# EAGLE design drum_circuits (EAGLE 7.6.0)
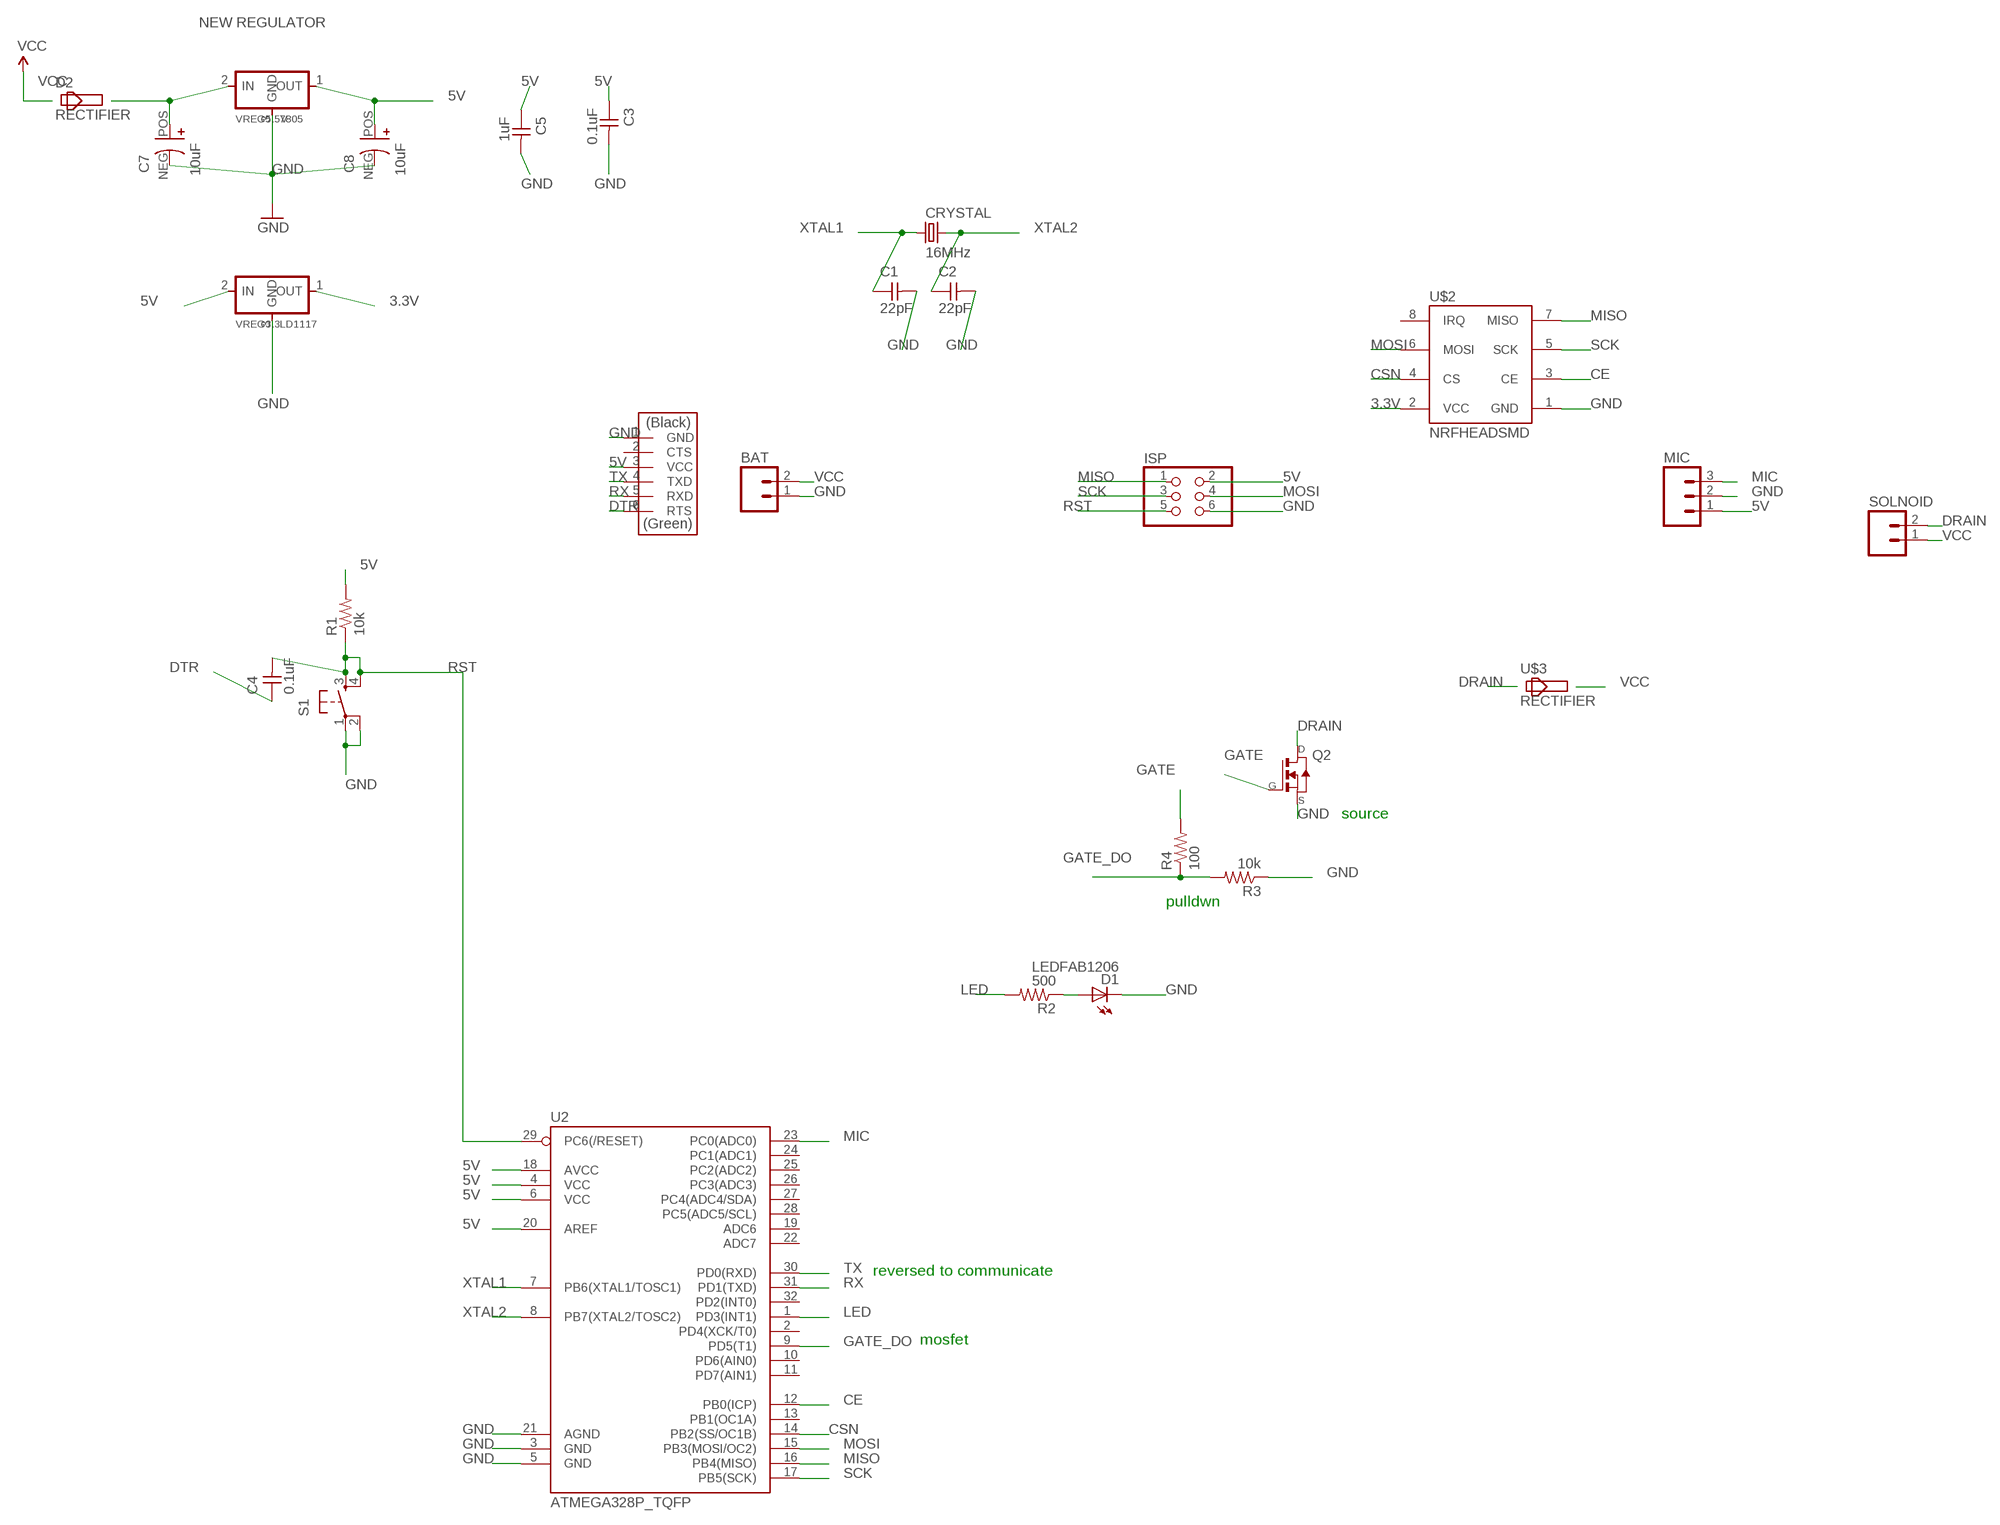
[diagram p0: schematic, sheet 1]

## Parts
BAT  M02PTH  [1X02]
C1  22pF  CAP-UNPOLARIZEDFAB  [C1206FAB]
C2  22pF  CAP-UNPOLARIZEDFAB  [C1206FAB]
C3  0.1uF  CAP-UNPOLARIZEDFAB  [C1206FAB]
C4  0.1uF  CAP-UNPOLARIZEDFAB  [C1206FAB]
C5  1uF  CAP-UNPOLARIZEDFAB  [C1206FAB]
C7  10uF  POLCAP-PANASONIC-SMD-B01  [PANASONIC-CAP-SMD-B]
C8  10uF  POLCAP-PANASONIC-SMD-B01  [PANASONIC-CAP-SMD-B]
CRYSTAL  16MHz  CRYSTAL  [2-SMD-5X3MM]
D1  LEDFAB1206  [LED1206FAB]
D2  RECTIFIER  [RECTIFIER]
ISP  PINHD-2X3-SMD  [2X03SMD]
MIC  M03PTH  [1X03]
Q2  NMOSFETSOT23  [SOT-23]
R1  10k  RES-US1206FAB  [R1206FAB]
R2  500  RES-US1206FAB  [R1206FAB]
R3  10k  RES-US1206FAB  [R1206FAB]
R4  100  RES-US1206FAB  [R1206FAB]
S1  6MM_SWITCH6MM_SWITCH  [6MM_SWITCH]
SOLNOID  M02PTH  [1X02]
U2  ATMEGA328P_TQFP  [TQFP32-08]
U$1  FTDI-SMD-HEADER  [1X06SMD]
U$2  NRFHEADSMD  [2.54MM]
U$3  RECTIFIER  [RECTIFIER]
VREG3.3  LD1117  REGULATORSOT23  [SOT23]
VREG5.5V  7805  REGULATORSOT23  [SOT23]

## Nets
3.3V: U$2.2(VCC) VREG3.3.1(OUT)
5V: C3.1 C5.1 C8.POS(+) ISP.2 MIC.1 R1.2 U2.4(VCC) U2.6(VCC) U2.18(AVCC) U2.20(AREF) U$1.3(VCC) VREG3.3.2(IN) VREG5.5V.1(OUT)
CE: U2.12(PB0(ICP)) U$2.3(CE)
CSN: U2.14(PB2(SS/OC1B)) U$2.4(CS)
DRAIN: Q2.1(D) SOLNOID.2 U$3.1
DTR: C4.1 U$1.6(RTS)
GATE: Q2.3(G) R4.2
GATE_DO: R3.2 R4.1 U2.9(PD5(T1))
GND: BAT.1 C1.2 C2.2 C3.2 C5.2 C7.NEG(-) C8.NEG(-) D1.2(C) ISP.6 MIC.2 Q2.2(S) R3.1 S1.1(P) S1.2(P1) U2.3(GND) U2.5(GND) U2.21(AGND) U$1.1(GND) U$2.1(GND) VREG3.3.3(GND) VREG5.5V.3(GND)
LED: R2.2 U2.1(PD3(INT1))
MIC: MIC.3 U2.23(PC0(ADC0))
MISO: ISP.1 U2.16(PB4(MISO)) U$2.7(MISO)
MOSI: ISP.4 U2.15(PB3(MOSI/OC2)) U$2.6(MOSI)
N$1: D1.1(A) R2.1
N$4: C7.POS(+) D2.2 VREG5.5V.2(IN)
RST: C4.2 ISP.5 R1.1 S1.3(S) S1.4(S1) U2.29(PC6(/RESET))
RX: U2.31(PD1(TXD)) U$1.5(RXD)
SCK: ISP.3 U2.17(PB5(SCK)) U$2.5(SCK)
TX: U2.30(PD0(RXD)) U$1.4(TXD)
VCC: BAT.2 D2.1 SOLNOID.1 U$3.2
XTAL1: C1.1 CRYSTAL.P$1 U2.7(PB6(XTAL1/TOSC1))
XTAL2: C2.1 CRYSTAL.P$2 U2.8(PB7(XTAL2/TOSC2))
Unconnected: U2.2(PD4(XCK/T0)) U2.10(PD6(AIN0)) U2.11(PD7(AIN1)) U2.13(PB1(OC1A)) U2.19(ADC6) U2.22(ADC7) U2.24(PC1(ADC1)) U2.25(PC2(ADC2)) U2.26(PC3(ADC3)) U2.27(PC4(ADC4/SDA)) U2.28(PC5(ADC5/SCL)) U2.32(PD2(INT0)) U$1.2(CTS) U$2.8(IRQ)

## Notes on the sheet
- NEW REGULATOR
- source
- pulldwn
- reversed to communicate
- mosfet

## Library data of the parts
BAT SOLNOID = SparkFun-Connectors:M02: Standard 2-pin 0.1" header. Use with - straight break away headers ( PRT-00116) - right angle break away headers (PRT-00553) - swiss pins (PRT-00743) - machine pins (PRT-00117) - female headers (PRT-00115) Molex polarized connector foot print use with: PRT-08233 with associated crimp pins and housings. 2.54_SCREWTERM for use with PRT-10571. 3.5mm Screw Terminal footprints for PRT-08084 5mm Screw Terminal footprints for use with PRT-08432
C1-C5 = fab:CAP-UNPOLARIZED
C7 C8 = talkingdrums:POLCAP-PANASONIC-SMD-B
CRYSTAL = fab:CRYSTAL
D1 = fab:LED: LED
D2 U$3 = talkingdrums:RECTIFIER
ISP = fab:PINHD-2X3-SMD: PIN HEADER
MIC = SparkFun-Connectors:M03: Header 3 Standard 3-pin 0.1" header. Use with straight break away headers (SKU : PRT-00116), right angle break away headers (PRT-00553), swiss pins (PRT-00743), machine pins (PRT-00117), and female headers (PRT-00115). Molex polarized connector foot print use with SKU : PRT-08232 with associated crimp pins and housings.
Q2 = fab:NMOSFET: MOS FET
R1-R4 = fab:RES-US: Resistor (US Symbol) Variants with postfix FAB are widened to allow the routing of internal traces
S1 = fab:6MM_SWITCH: OMRON SWITCH
U2 = SparkFun-DigitalIC:ATMEGA328P_TQFP; PROD_ID: IC-09069
U$1 = fab:FTDI-SMD-HEADER
U$2 = nrf:NRFHEAD
VREG3.3 VREG5.5V = fab:REGULATOR

## Board
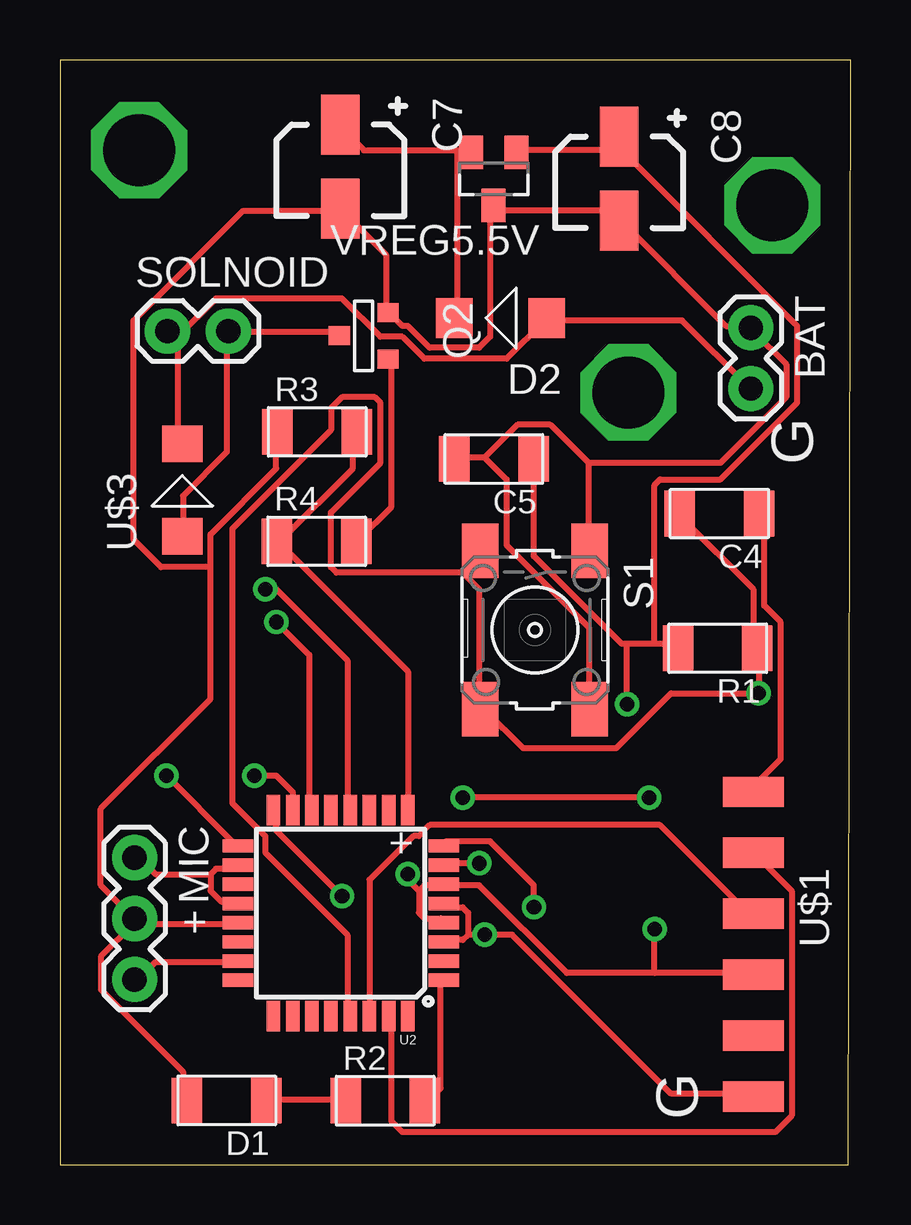
[diagram p1: board, top side]
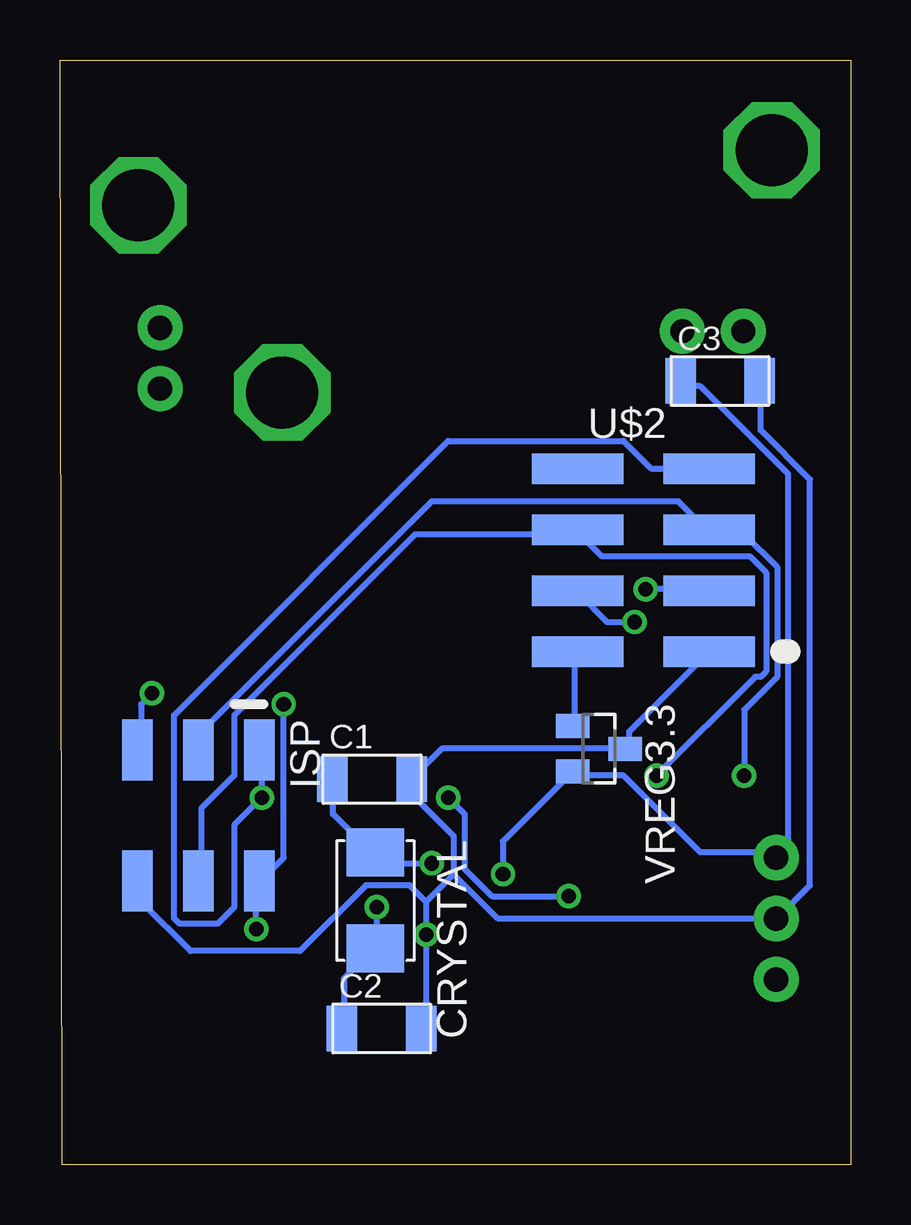
[diagram p2: board, bottom side, seen from below]

Size 32.97 x 46.06 mm. Coordinates in mm from the lower left corner, seen from the top.
Outline: 0,0 32.87,0 32.97,46.06 0,46.06 0,0
Copper layers (1*16): Top 0.035mm / dielectric 1.5mm / Bottom 0.035mm
Design rules "default": minimum track width 10mil, minimum drill 24mil, track to track 8mil, track to pad 8mil, pad to pad 8mil, via to via 8mil, smd to smd 8mil, copper to edge 40mil, drill to drill 8mil, minimum pad ring 10mil, minimum via ring 8mil, stop-mask expansion 4mil, vias tented up to drill 0mil, thermal gap 10mil

### Footprints (pad centres in the part's own frame; a part is rotated, then mirrored left to right if it is on the bottom)
1X02 = drill 1.016 pad 1.88: 1 0,0; 2 2.54,0
C1206FAB = smd 1.27 x 1.905: 1 -1.651,0; 2 1.651,0
PANASONIC-CAP-SMD-B = smd 1.6 x 2.5: NEG 0,3.5; POS 0,0
2-SMD-5X3MM = smd 2 x 2.4: P$1 -2,0; P$2 2,0
LED1206FAB = smd 1.27 x 1.905: 1 -1.651,0; 2 1.651,0
RECTIFIER = smd 1.524 x 1.676: 1 0,0; 2 3.861,0
2X03SMD = smd 2.54 x 1.27: 1 -2.54,2.54; 2 2.92,2.54; 3 -2.54,0; 4 2.92,0; 5 -2.54,-2.54; 6 2.92,-2.54
1X03 = drill 1.016 pad 1.88: 1 0,0; 2 2.54,0; 3 5.08,0
SOT-23 = smd 0.787 x 0.889: 1 0.025,-1.016; 2 -0.94,1.016; 3 0.991,1.016
R1206FAB = smd 1.27 x 1.905: 1 -1.651,0; 2 1.651,0
6MM_SWITCH = smd 2.286 x 1.524: 1 -3.302,2.286; 2 3.302,2.286; 3 -3.302,-2.286; 4 3.302,-2.286
TQFP32-08 = smd 1.27 x 0.559: 1 -4.293,2.8; 2 -4.293,2; 3 -4.293,1.2; 4 -4.293,0.4; 5 -4.293,-0.4; 6 -4.293,-1.2; 7 -4.293,-2; 8 -4.293,-2.8; 17 4.293,-2.8; 18 4.293,-2; 19 4.293,-1.2; 20 4.293,-0.4; 21 4.293,0.4; 22 4.293,1.2; 23 4.293,2; 24 4.293,2.8 | smd 0.559 x 1.27: 9 -2.8,-4.293; 10 -2,-4.293; 11 -1.2,-4.293; 12 -0.4,-4.293; 13 0.4,-4.293; 14 1.2,-4.293; 15 2,-4.293; 16 2.8,-4.293; 25 2.8,4.293; 26 2,4.293; 27 1.2,4.293; 28 0.4,4.293; 29 -0.4,4.293; 30 -1.2,4.293; 31 -2,4.293; 32 -2.8,4.293
1X06SMD = smd 2.54 x 1.27: 1 0,6.35; 2 0,3.81; 3 0,1.27; 4 0,-1.27; 5 0,-3.81; 6 0,-6.35
2.54MM = smd 3.81 x 1.27: 1 0,0; 2 -5.486,0; 3 0,2.54; 4 -5.486,2.54; 5 0,5.08; 6 -5.486,5.08; 7 0,7.62; 8 -5.486,7.62
SOT23 = smd 1 x 1.4: 1 -0.95,-1.1; 2 0.95,-1.1; 3 0,1.1

### Placement (x,y rotation side)
BAT  28.8,34.9 270 top
C1  19.96,16.08 0 bottom
C2  19.56,5.69 0 bottom
C3  5.45,32.68 0 bottom
C4  27.49,27.15 180 top
C5  18.09,29.43 180 top
C7  11.69,43.37 180 top
C8  23.32,42.87 180 top
CRYSTAL  19.82,11.02 270 bottom
D1  6.95,2.69 180 top
D2  20.3,35.3 180 top
ISP  27.2,14.76 270 bottom
MIC  3.11,12.81 270 top
Q2  12.66,34.59 270 top
R1  27.42,21.54 180 top
R2  13.56,2.68 0 top
R3  10.72,30.56 0 top
R4  10.7,26 0 top
S1  19.8,22.3 270 top
SOLNOID  4.48,34.76 0 top
U2  11.7,10.5 180 top
U$1  28.9,9.2 180 top
U$2  5.9,21.4 0 bottom
U$3  5.1,26.2 90 top
VREG3.3  10.5,17.35 270 bottom
VREG5.5V  18.08,41.1 180 top

### Tracks (layer width: path | path; a pad name or v marks a point on that pad's centre or on a via)
3.3V
  Bottom 0.254: VREG3.3.1 11.53,18.52 11.53,21.26 U$2.2
5V  (via drill 0.61)
  Top 0.254: VREG5.5V.1 19.07,42.29 22.73,42.29 23.19,42.75 C8.POS 23.42,42.75 23.42,42.29 30.73,34.98 30.73,31.77 27.53,28.57 25.02,28.57 24.79,28.35 24.79,21.72 | 24.79,21.72 25.7,21.72 R1.2 | 24.79,21.72 23.65,21.72 | 23.65,21.72 23.42,21.72 19.76,25.38 19.76,29.26 C5.1 | 14.96,11.43 14.96,10.52 15.19,10.29 15.87,10.29 U2.4 | 14.96,11.43 15.19,11.66 15.87,11.66 U2.6 16.1,11.66 17.47,11.66 21.13,8 24.79,8 | 24.79,8 28.68,8 U$1.3 | 24.79,8 v24.79,9.83 | 6.27,12.12 6.27,11.43 6.73,10.97 7.19,10.97 U2.20 | 6.27,12.12 6.5,12.34 7.19,12.34 U2.18 | 6.27,12.12 3.99,12.12 3.3,12.8 MIC.1 | 14.96,11.43 14.5,11.89 v14.5,12.12 | v23.65,19.2 23.65,21.72
  Bottom 0.254: v24.79,9.83 24.79,11.66 ISP.2 24.56,11.89 23.65,12.8 v23.65,19.2 | C3.1 6.96,32.46 6.27,32.46 2.62,28.8 2.62,13.49 3.07,13.03 MIC.1 3.3,13.03 6.27,13.03 9.47,16.23 11.53,16.23 VREG3.3.2 11.76,16.23 14.5,13.49 v14.5,12.12
CE  (via drill 0.61)
  Top 0.254: v8.56,24 9.01,24 11.99,21.03 11.99,14.86 U2.12
  Bottom 0.254: v8.56,24 6.04,24 U$2.3
CSN  (via drill 0.61)
  Top 0.254: v9.01,22.63 10.39,21.26 10.39,14.86 U2.14
  Bottom 0.254: v9.01,22.63 10.16,22.63 11.3,23.77 U$2.4
DRAIN
  Top 0.254: Q2.1 11.53,34.75 7.19,34.75 SOLNOID.2 6.96,34.75 6.96,29.72 5.13,27.89 5.13,26.29 U$3.1
DTR
  Top 0.254: C4.1 29.36,26.98 29.36,23.32 30.05,22.63 30.05,16.92 28.9,15.77 U$1.6
GATE
  Top 0.254: Q2.3 13.82,33.38 13.82,27.43 12.44,26.06 R4.2
GATE_DO
  Top 0.254: U2.9 14.5,14.86 14.5,20.57 9.24,25.83 R4.1 9.24,26.06 12.22,29.03 12.22,30.4 R3.2
GND  (via drill 0.61)
  Top 0.254: 17.7,29.49 16.56,29.49 C5.2 | 17.7,29.49 19.07,30.86 20.45,30.86 22.05,29.26 | 22.05,29.26 22.05,25.6 S1.1 | 17.7,29.49 18.62,28.57 18.62,25.83 22.05,22.4 22.05,19.2 S1.2 | 22.05,29.26 27.53,29.26 30.28,32 30.28,33.38 28.9,34.75 BAT.1 28.68,34.98 27.76,34.98 23.42,39.32 C8.NEG 23.19,39.55 22.96,39.78 18.16,39.78 VREG5.5V.3 17.93,39.78 17.93,34.52 17.47,34.06 15.42,34.06 14.5,34.98 14.27,34.98 13.82,35.43 Q2.2 13.59,35.66 13.59,37.95 11.76,39.78 C7.NEG 11.53,39.78 7.64,39.78 3.07,35.2 3.07,26.06 4.21,24.92 6.27,24.92 | U2.21 7.19,10.06 3.3,10.06 MIC.2 | D1.2 5.13,2.74 5.13,3.89 1.7,7.32 1.7,8.69 3.07,10.06 MIC.2 | 6.27,24.92 6.27,19.43 1.7,14.86 1.7,11.66 3.07,10.29 MIC.2 | 6.27,24.92 6.27,26.29 9.01,29.03 9.01,30.4 R3.1 | 17.02,9.6 16.79,9.37 16.1,9.37 U2.3 | 17.02,9.6 17.02,10.52 16.79,10.74 16.1,10.74 U2.5 | 17.02,9.6 v17.7,9.6 18.85,9.6 25.48,2.97 28.68,2.97 U$1.1
  Bottom 0.254: C3.2 3.76,32.46 3.76,30.63 1.7,28.57 1.7,11.66 3.07,10.29 MIC.2 3.3,10.29 14.73,10.29 16.56,12.12 | U$2.1 6.04,21.26 9.24,18.06 9.24,17.37 VREG3.3.3 9.47,17.37 17.02,17.37 18.16,16.23 C1.2 18.16,16 18.16,15.32 16.56,13.72 16.56,12.12 | 17.7,10.97 v17.7,9.6 17.7,5.71 C2.2 | 16.56,12.12 17.7,10.97 | 17.7,10.97 18.39,11.66 20.22,11.66 22.96,8.91 27.53,8.91 29.59,10.97 29.59,11.66 ISP.6
LED
  Top 0.254: U2.1 15.87,7.54 15.87,3.2 15.42,2.74 R2.2
MIC
  Top 0.254: U2.23 7.19,8.46 3.99,8.46 3.3,7.77 MIC.3
MISO  (via drill 0.61)
  Top 0.254: v11.76,11.2 9.01,13.95 9.01,14.63 U2.16 | v24.56,15.32 v16.79,15.32
  Bottom 0.254: v11.76,11.2 14.96,11.2 16.1,12.34 16.1,14.63 v16.79,15.32 | ISP.1 24.56,17.14 v24.56,15.32 25.7,14.17 25.7,10.74 26.39,10.06 27.99,10.06 28.22,10.29 28.22,18.75 16.79,30.18 9.47,30.18 8.33,29.03 6.04,29.03 U$2.7
MOSI  (via drill 0.61)
  Top 0.254: v8.1,16.23 9.01,16.23 9.7,15.54 9.7,14.86 U2.15
  Bottom 0.254: v8.1,16.23 3.99,20.34 3.76,20.34 3.53,20.57 3.53,24.69 4.21,25.38 10.39,25.38 11.3,26.29 U$2.6 11.53,26.29 18.16,26.29 25.7,18.75 25.7,16.23 27.08,14.86 27.08,11.89 ISP.4
N$1
  Top 0.254: R2.1 11.76,2.74 8.79,2.74 D1.1
N$2  (via drill 3 pad 1)
  other vias: 23.7,32.2
N$3  (via drill 3 pad 1)
  other vias: 3.3,42.3
N$4
  Top 0.254: 16.56,42.29 12.67,42.29 11.76,43.2 C7.POS | 16.56,42.29 17.02,42.29 VREG5.5V.2 | 16.56,42.29 16.56,35.43 D2.2
N$5  (via drill 3 pad 1)
  other vias: 29.7,40
RST  (via drill 0.61)
  Top 0.254: C4.2 25.93,26.98 28.9,24 28.9,21.72 R1.1 29.13,21.49 v29.13,19.66 25.48,19.66 23.19,17.37 19.3,17.37 17.7,18.97 S1.4 17.47,19.2 17.47,24 16.79,24.69 | 16.79,24.69 11.53,24.69 11.3,24.92 11.3,27.2 13.36,29.26 13.36,31.77 13.13,32 11.76,32 11.3,31.55 11.3,30.63 7.19,26.52 7.19,15.09 8.56,13.72 8.56,13.03 11.99,9.6 11.99,6.4 U2.29 | 16.79,24.69 17.47,25.38 S1.3 16.79,24.69
  Bottom 0.254: v29.13,19.66 29.59,19.2 29.59,17.37 ISP.5
RX
  Top 0.254: U2.31 13.82,6.17 13.82,1.83 14.27,1.37 29.82,1.37 30.5,2.06 30.5,11.43 28.9,13.03 U$1.5
SCK  (via drill 0.61)
  Top 0.254: v4.44,16.23 7.19,13.49 U2.17
  Bottom 0.254: v4.44,16.23 4.44,18.97 3.07,20.34 3.07,24.92 4.44,26.29 5.81,26.29 U$2.5 6.04,26.52 7.19,27.66 17.47,27.66 27.08,18.06 27.08,17.37 ISP.3
TX
  Top 0.254: U2.30 12.9,6.4 12.9,11.89 14.73,13.72 14.96,13.72 15.42,14.17 25.02,14.17 28.68,10.52 U$1.4
VCC
  Top 0.254: 4.9,34.52 4.9,30.18 U$3.2 | 4.9,34.52 4.67,34.75 SOLNOID.1 4.9,34.52 | BAT.2 28.68,32.46 25.93,35.2 20.45,35.2 D2.1 20.22,35.2 18.62,33.6 15.19,33.6 14.27,34.52 13.36,34.52 11.76,36.12 6.5,36.12 4.9,34.52
XTAL1  (via drill 0.61)
  Top 0.254: v17.47,12.57 16.1,12.57 U2.7
  Bottom 0.254: v17.47,12.57 19.53,12.57 19.76,12.8 CRYSTAL.P$1 19.99,13.03 21.59,14.63 21.59,16 C1.1
XTAL2  (via drill 0.61)
  Top 0.254: v19.76,10.74 19.76,11.66 17.93,13.49 16.1,13.49 U2.8
  Bottom 0.254: v19.76,10.74 19.76,9.14 CRYSTAL.P$2 19.99,8.91 21.13,7.77 21.13,5.71 C2.1

### Text on the board
tPlace: G | + | - | + | G